# Altium schematic sheet RouterBatteryLED.SchDoc
size A
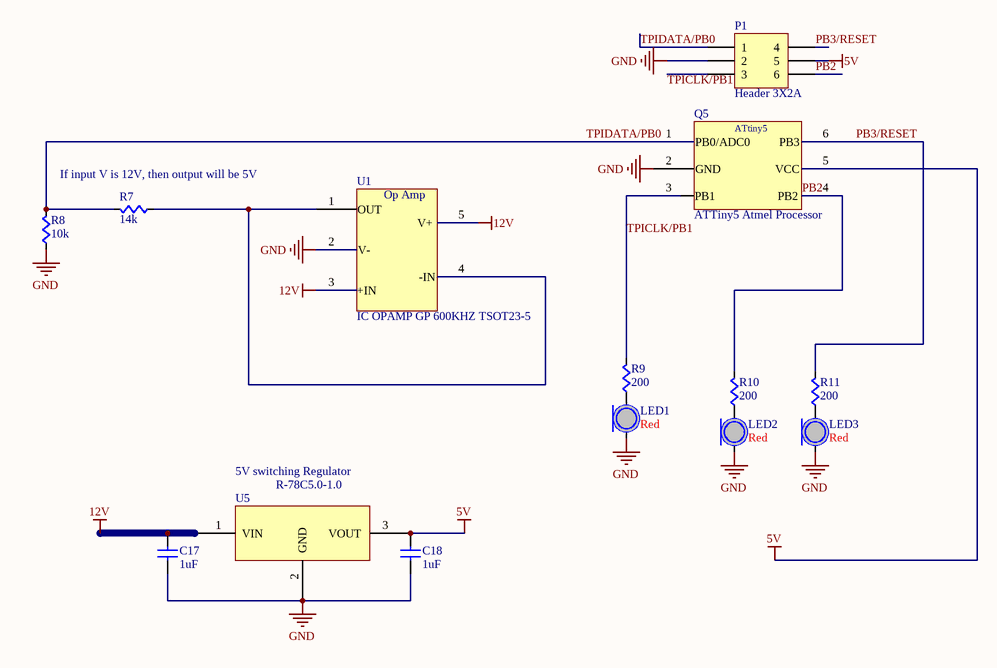
[diagram p0: RouterBatteryLED.SchDoc]

## Parts
C17  value 1uF  [CAPC0603]  (hidden comment: Cap)
C18  value 1uF  [CAPC0603]  (hidden comment: Cap)
LED1  Color: Red  [LED0603]  (hidden comment: LED)
LED2  Color: Red  [LED0603]  (hidden comment: LED)
LED3  Color: Red  [LED0603]  (hidden comment: LED)
P1  Header 3X2A  [HDR2X3_CEN]
Q5  ATTiny5 Atmel Processor  [ATTiny5]
R7  value 14k  [RES0603]  (hidden comment: Res)
R8  value 10k  [RES0603]  (hidden comment: Res)
R9  value 200  [RES0603]  (hidden comment: Res)
R10  value 200  [RES0603]  (hidden comment: Res)
R11  value 200  [RES0603]  (hidden comment: Res)
U1  IC OPAMP GP 600KHZ TSOT23-5  [SOT95P280X100-5N]
U5  R-78C5.0-1.0  [R-78C5.0-1.0]

## Nets
5V: C18.1(A) P1.5 Q5.5(VCC) U5.3(VOUT)
12V: C17.1(A) U1.3(+IN) U1.5(V+) U5.1(VIN)
GND: C17.2(B) C18.2(B) LED1.C LED2.C LED3.C P1.2 R8.2(B) U1.2(V-) U5.2(GND)
PB2: P1.6 Q5.4(PB2) R10.1(A)
PB3/RESET: P1.4 Q5.6(PB3) R11.1(A)
TPICLK/PB1: R9.1(A)
TPIDATA/PB0: P1.1 Q5.1(PB0/ADC0) R7.1(A) R8.1(A)
NetLED1_A: LED1.A R9.2(B)
NetLED2_A: LED2.A R10.2(B)
NetLED3_A: LED3.A R11.2(B)
NetR7_2: R7.2(B) U1.4(-IN)

Not connected (* = marked no-connect by the designer): P1 3; Q5 2(GND) 3(PB1); U1 1(OUT)

## Notes on the sheet
- If input V is 12V, then output will be 5V
- 5V switching Regulator
- Labels drawn without touching a wire or pin: GND, TPICLK/PB1
- (in symbol ATTiny5 Atmel Processor) ATtiny5
- (in symbol IC OPAMP GP 600KHZ TSOT23-5) Op Amp

## Library data of the parts
P1 = Header 3X2A: Header, 3-Pin, Dual row; LatestRevisionDate: 17-Jul-2002; LatestRevisionNote: Re-released for DXP Platform.; Publisher: Altium Limited
Q5 = ATTiny5 Atmel Processor: Manufacturer Part #: ATTINY5-TSHR; DigiKey Part Number: ATTiny5-TSHRCT-ND
U1 = IC OPAMP GP 600KHZ TSOT23-5: Manufacturer Part #: AD8677AUJZ-REEL7; DigiKey Part #: AD8677AUJZ-REEL7CT-ND
U5 = R-78C5.0-1.0: CONV DC/DC 1A 5V OUT SIP VERT; Supplier 1: Digi-Key; Supplier Part Number 1: 945-1395-5-ND
C17 C18 = Cap: Supplier 1: Digi-Key; Supplier Part Number 1: 1276-1860-1-ND
LED1-LED3 = LED: Supplier 1: Digi-Key; Supplier Part Number 1: 754-1122-1-ND
R7-R11 = Res: Supplier 1: Digi-Key; Supplier Part Number 1: RMCF0603JT10K0CT-ND